# Altium schematic sheet TIEMPOS.SchDoc
size A
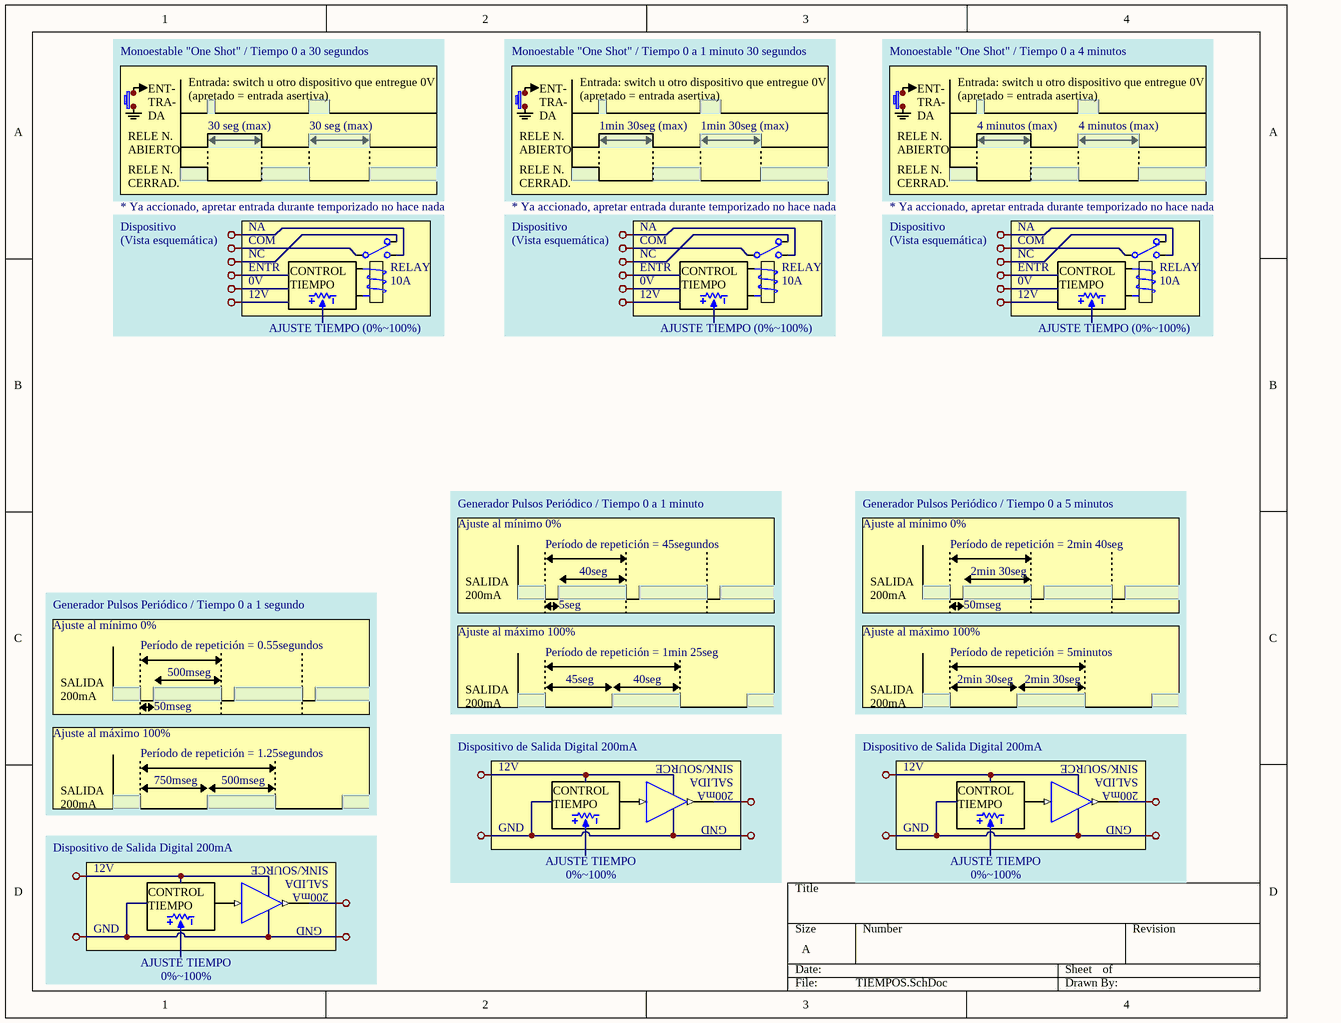
[diagram p0: TIEMPOS.SchDoc]

## Parts
(Parts that share a designator on the sheet are numbered #1, #2 ... from top to bottom, then left to right.)
K?#1  Relay2  [RELAY2]  (value not drawn)
K?#2  Relay2  [RELAY2]  (value not drawn)
K?#3  Relay2  [RELAY2]  (value not drawn)
R?#1  Set Position: AJUSTE TIEMPO (0%~100%)  [conpol4x1]  (hidden comment: RVar)  (part A of 2)
R?#2  Set Position: AJUSTE TIEMPO (0%~100%)  [conpol4x1]  (hidden comment: RVar)  (part A of 2)
R?#3  Set Position: AJUSTE TIEMPO (0%~100%)  [conpol4x1]  (hidden comment: RVar)  (part A of 2)
R?#4  Set Position: AJUSTE TIEMPO  Price: 0%~100%  [conpol4x1]  (hidden comment: RVar)  (part A of 2)
R?#5  Set Position: AJUSTE TIEMPO  Price: 0%~100%  [conpol4x1]  (hidden comment: RVar)  (part A of 2)
R?#6  Set Position: AJUSTE TIEMPO  Price: 0%~100%  [conpol4x1]  (hidden comment: RVar)  (part A of 2)
U?#1  74HC04  [SO14]  (value not drawn)  (part A of 6)
U?#2  74HC04  [SO14]  (value not drawn)  (part A of 6)
U?#3  74HC04  [SO14]  (value not drawn)  (part A of 6)

## Nets
GND: U?#1.7(GND) U?#2.7(GND) U?#3.7(GND)
NetK?#1_1: K?#1.1 K?#1.2 K?#1.3 K?#2.1 K?#2.2 K?#2.3 K?#3.1 K?#3.2 K?#3.3 U?#1.2(Y) U?#2.2(Y) U?#3.2(Y)
VCC: U?#1.14(VCC) U?#2.14(VCC) U?#3.14(VCC)

Not connected (* = marked no-connect by the designer): K?#1 4 5; K?#2 4 5; K?#3 4 5; R?#1 1 2 3; R?#2 1 2 3; R?#3 1 2 3; R?#4 1 2 3; R?#5 1 2 3; R?#6 1 2 3; U?#1 1(A); U?#2 1(A); U?#3 1(A)

## Notes on the sheet
- Monoestable "One Shot" / Tiempo 0 a 30 segundos
- Entrada: switch u otro dispositivo que entregue 0V
  (apretado = entrada asertiva)
- Monoestable "One Shot" / Tiempo 0 a 1 minuto 30 segundos
- Monoestable "One Shot" / Tiempo 0 a 4 minutos
- RELE N. ABIERTO
- ENT-
  TRA-
  DA
- 30 seg (max)
- 1min 30seg (max)
- 4 minutos (max)
- Dispositivo
- (near K?#1) * Ya accionado, apretar entrada durante temporizado no hace nada
- RELE N. CERRAD.
- NA
- (near K?#2) * Ya accionado, apretar entrada durante temporizado no hace nada
- (near K?#3) * Ya accionado, apretar entrada durante temporizado no hace nada
- (Vista esquemática)
- (near R?#1) 12V
- (near R?#1) 0V
- (near R?#1) ENTR
- NC
- COM
- (near K?#1) RELAY
- (near K?#1) 10A
- (near R?#2) 12V
- (near R?#2) 0V
- (near R?#2) ENTR
- (near K?#2) RELAY
- (near K?#2) 10A
- (near R?#3) 12V
- (near R?#3) 0V
- (near R?#3) ENTR
- (near K?#3) RELAY
- (near K?#3) 10A
- (near R?#1) CONTROL TIEMPO
- (near R?#2) CONTROL TIEMPO
- (near R?#3) CONTROL TIEMPO
- Generador Pulsos Periódico / Tiempo 0 a 1 minuto
- Generador Pulsos Periódico / Tiempo 0 a 5 minutos
- Ajuste al mínimo 0%
- Período de repetición = 45segundos
- Período de repetición = 2min 40seg
- Generador Pulsos Periódico / Tiempo 0 a 1 segundo
- Ajuste al máximo 100%
- SALIDA
  200mA
- 5seg
- 40seg
- 50mseg
- 2min 30seg
- Período de repetición = 0.55segundos
- 500mseg
- Período de repetición = 1min 25seg
- 45seg
- Período de repetición = 5minutos
- Período de repetición = 1.25segundos
- Dispositivo de Salida Digital 200mA
- 12V
- (near U?#1) SALIDA
- (near U?#1) SINK/SOURCE
- (near U?#2) SALIDA
- (near U?#2) SINK/SOURCE
- 750mseg
- GND
- (near R?#4) CONTROL TIEMPO
- (near U?#1) GND
- (near U?#1) 200mA
- (near R?#5) CONTROL TIEMPO
- (near U?#2) GND
- (near U?#2) 200mA
- (near U?#3) SALIDA
- (near U?#3) 200mA
- (near U?#3) SINK/SOURCE
- (near R?#6) CONTROL TIEMPO
- (near U?#3) GND

## Library data of the parts
K?#1-K?#3 = Relay2: Relay; Price: ?; Current: ?
R?#1-R?#6 = RVar: Resistencia Variable; Value: 1K
U?#1-U?#3 = 74HC04: Hex Inverter; Price: ?